# EasyEDA Pro project 2022-4T-MNT-3.eprj

# Schematic EDA3.2
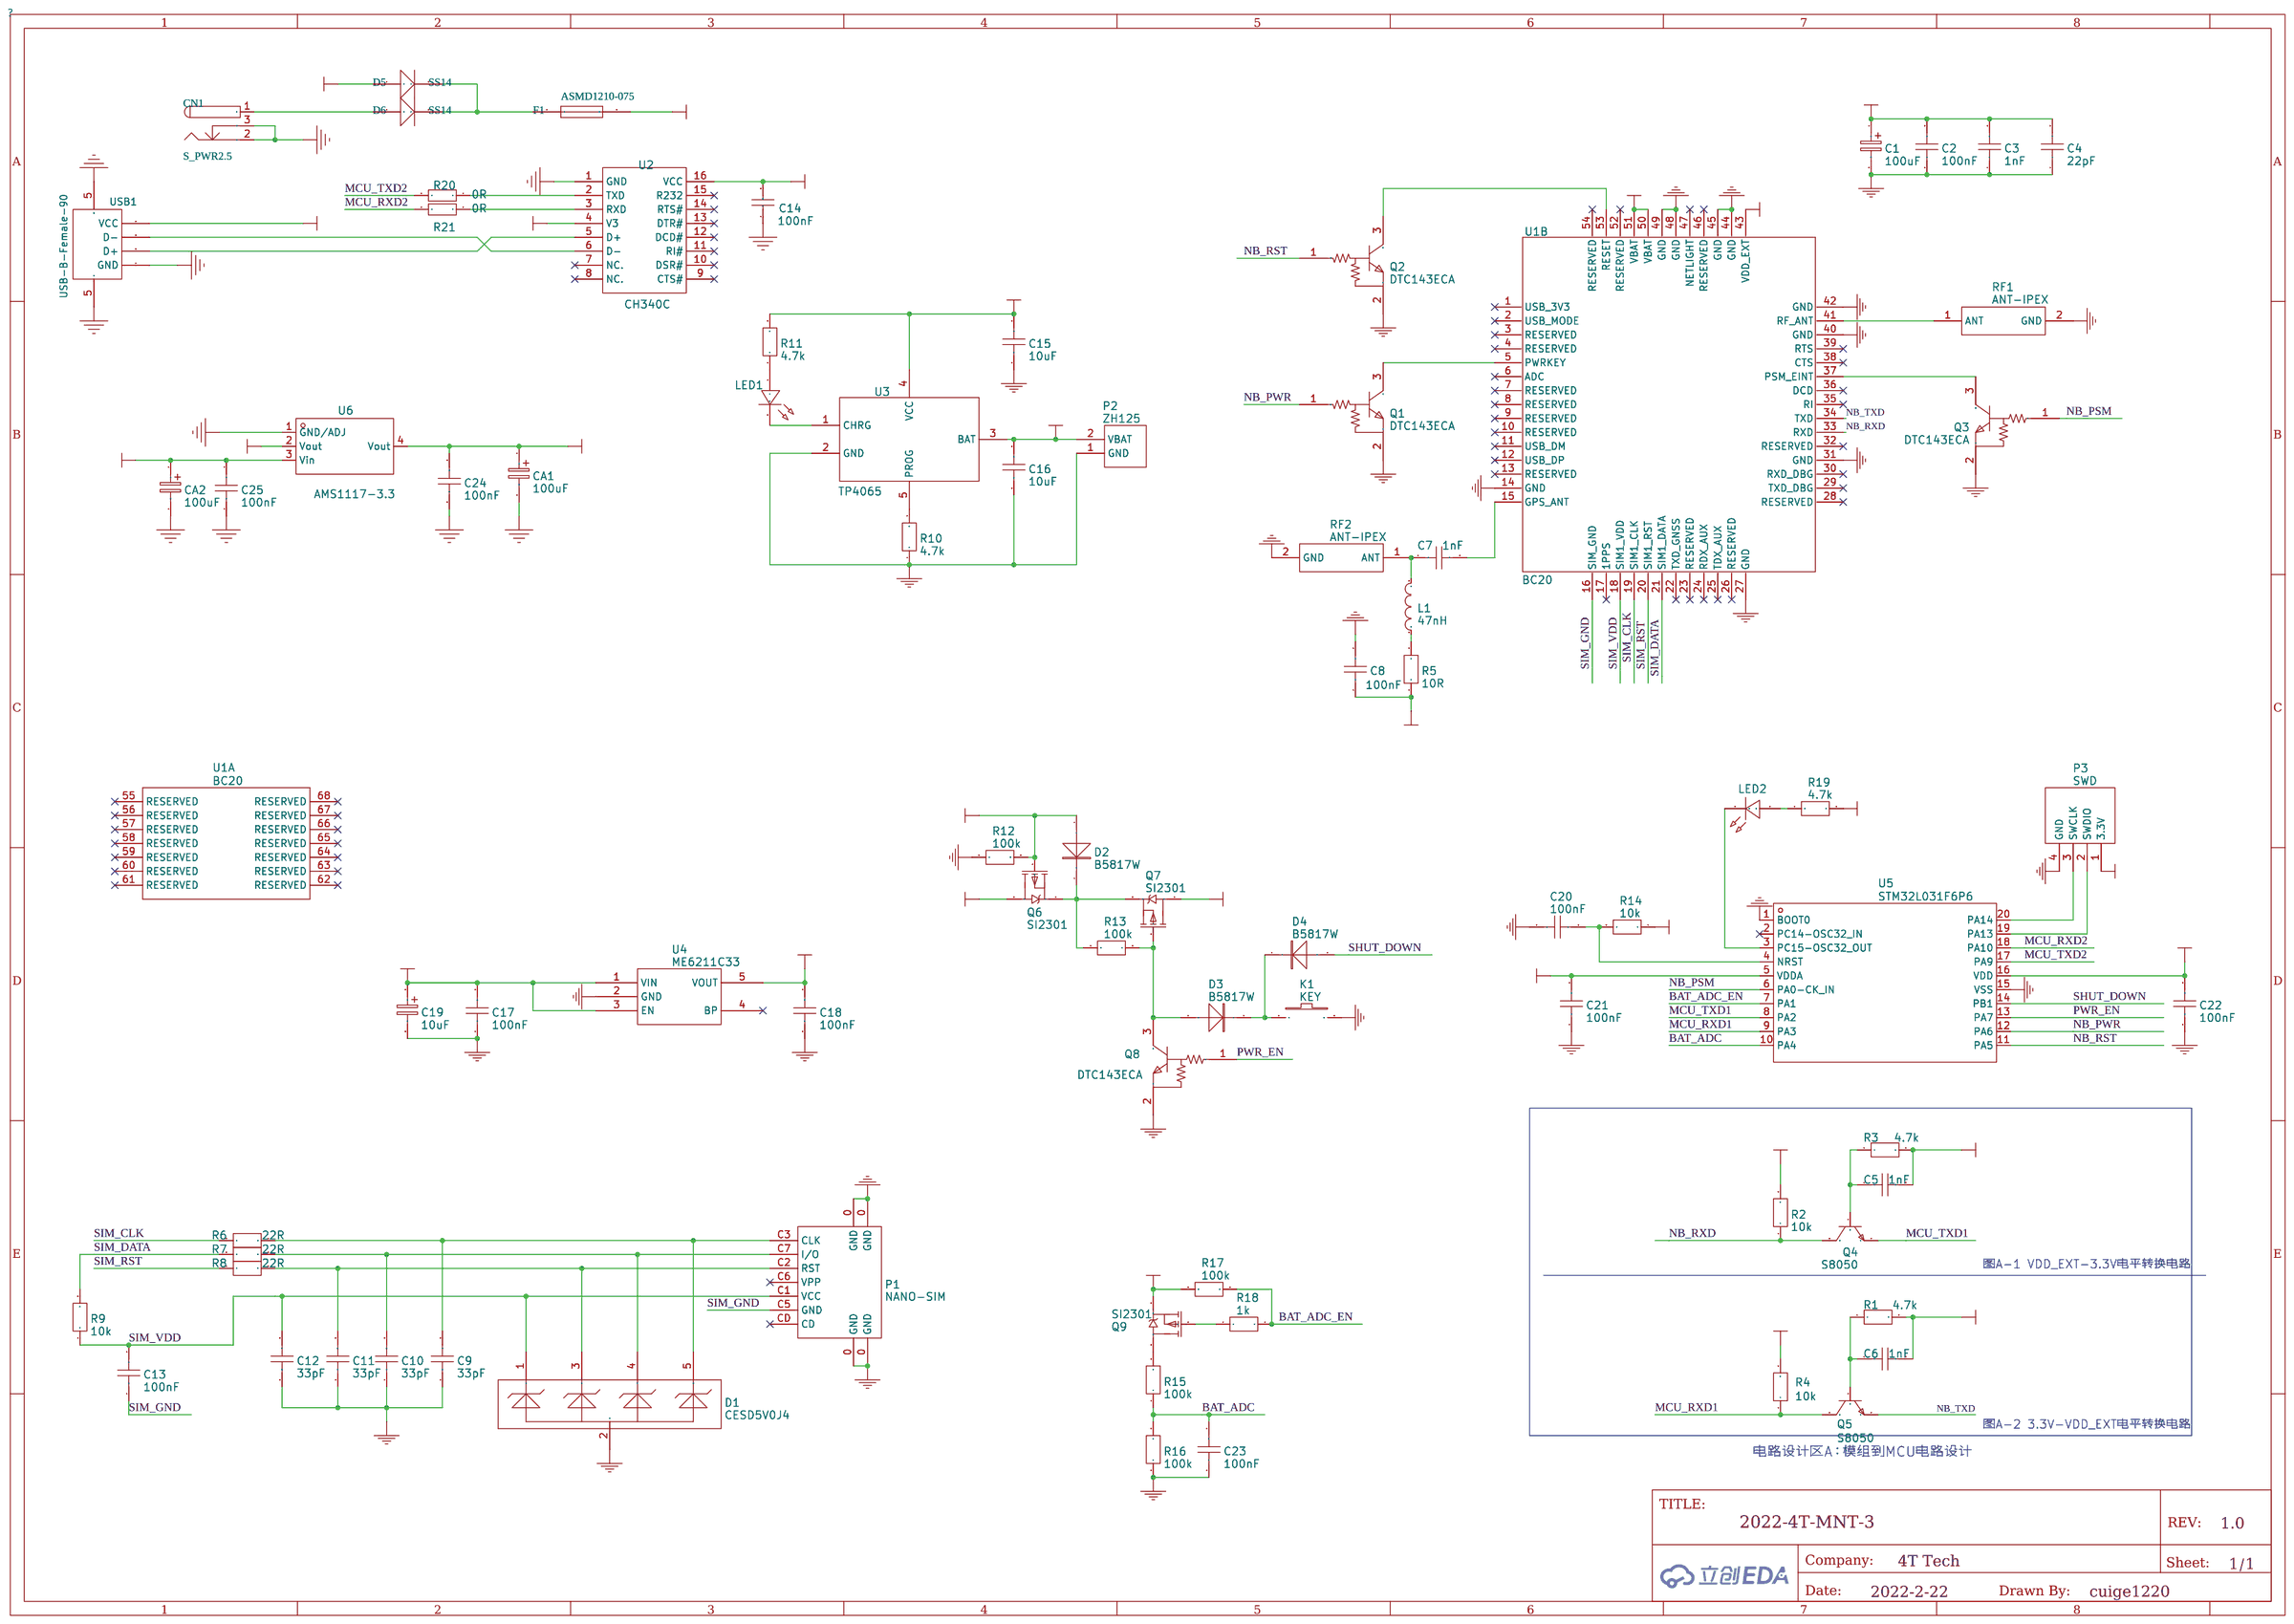
[diagram p0: schematic sheet]

## Parts
C1  100uF  [C0805]
C2  100nF  [C0805]
C3  1nF  [C0805]
C4  22pF  [C0805]
C5  1nF  [C0805]
C6  1nF  [C0805]
C7  1nF  [C0805]
C8  100nF  [C0805]
C9  33pF  [C0805]
C10  33pF  [C0805]
C11  33pF  [C0805]
C12  33pF  [C0805]
C13  100nF  [C0805]
C14  100nF  [C0805]
C15  10uF  [C0805]
C16  10uF  [C0805]
C17  100nF  [C0805]
C18  100nF  [C0805]
C19  10uF  [C_CAP-6*H]
C20  100nF  [C0805]
C21  100nF  [C0805]
C22  100nF  [C0805]
C23  100nF  [C0805]
C24  100nF  [C0805]
C25  100nF  [C0805]
CA1  100uF  [C_CAP-6*H]
CA2  100uF  [C_CAP-6*H]
CN1  S_PWR2.5  [PWR2.5]
D1  CESD5V0J4  [SOT-353]
D2  B5817W  [SOD-123]
D3  B5817W  [SOD-123]
D4  B5817W  [SOD-123]
D5  SS14  [D_DIO-SMA]
D6  SS14  [D_DIO-SMA]
F1  ASMD1210-075  [R_R1210]
K1  KEY  [SW-SMD_TSA365G00D-250]
L1  47nH  [L0805]
LED1  LED-0805_R  [LED0805_RED]
LED2  LED-0805_R  [LED0805_RED]
P1  NANO-SIM  [SIM-NANO_SMN-303]
P2  ZH125  [HDR-M-2.54_1X2]
P3  SWD  [HDR-M-2.54_1X4]
Q1  DTC143ECA  [SOT-23]
Q2  DTC143ECA  [SOT-23]
Q3  DTC143ECA  [SOT-23]
Q4  S8050  [SOT-23]
Q5  S8050  [SOT-23]
Q6  SI2301  [SOT-23]
Q7  SI2301  [SOT-23]
Q8  DTC143ECA  [SOT-23]
Q9  SI2301  [SOT-23]
R1  4.7k  [R0805]
R2  10k  [R0805]
R3  4.7k  [R0805]
R4  10k  [R0805]
R5  10R  [R0805]
R6  22R  [R0805]
R7  22R  [R0805]
R8  22R  [R0805]
R9  10k  [R0805]
R10  4.7k  [R0805]
R11  4.7k  [R0805]
R12  100k  [R0805]
R13  100k  [R0805]
R14  10k  [R0805]
R15  100k  [R0805]
R16  100k  [R0805]
R17  100k  [R0805]
R18  1k  [R0805]
R19  4.7k  [R0805]
R20  0R  [R0805]
R21  0R  [R0805]
RF1  ANT-IPEX  [ANT-IPEX]
RF2  ANT-IPEX  [ANT-IPEX]
U1  BC20  [LCC54]  (sections 1,2)
U2  CH340C  [SOIC-16_150MIL]
U3  TP4065  [SOT-23-5]
U4  ME6211C33  [SOT-23-5]
U5  STM32L031F6P6  [TSSOP-20]
U6  AMS1117-3.3  [SOP-SOT-223]
USB1  USB-B-Female-90  [S_USB-B]

## Library data of the parts
C1 CA1 CA2 = 100uF
C2 C8 C13 C20-C23 = TCC0603X7R104K500CT: Supplier Part: C282519; Supplier: LCSC; Manufacturer: CCTC
C3 C7 = CL10C101JB8NNNC: Supplier Part: C14858; Supplier: LCSC; Manufacturer: SAMSUNG
C4 = 22pF
C5 C6 = 1nF
C9-C12 = 33pF
C14 = 0805F104M500NT: Supplier: LCSC; Manufacturer: FH; Supplier Part: C28378
C15 C16 C19 = 10uF
C17 C18 C24 C25 = 100nF
CN1 = S_PWR2.5
D1 = CESD5V0J4: Supplier: LCSC; Manufacturer: CJ江苏长电; Supplier Part: C148117
D2-D4 = B5817W: Supplier: LCSC; Supplier Part: C8597; Manufacturer: CJ江苏长电
D5 D6 = SS14: Published: 8-Jun-2000; LatestRevisionDate: 17-Jul-2002; LatestRevisionNote: Re-released for DXP Platform.; PackageVersion: Sep-1996; PackageReference: SMC; Publisher: Altium Limited; PackageDescription: DO-214-AB/SMC; 2 C-Bend Leads; Body 7.9 x 5.9 mm, inc. leads (LxW); Code_JEDEC: DO-214-AB
F1 = ASMD1210-075: Published: 8-Jun-2000; LatestRevisionDate: 17-Jul-2002; LatestRevisionNote: Re-released for DXP Platform.; PackageReference: PIN-W2/E2.8; Publisher: Altium Limited; PackageDescription: Thru-Hole; 2 Leads
K1 = TSA365G00D-250: Manufacturer: BRIGHT(博瑞泰); Supplier: LCSC; Supplier Part: C354950
L1 = 47nH
LED1 LED2 = 17-21SURC/S530-A3/TR8: Manufacturer: EVERLIGHT(台湾亿光); Supplier Part: C72037
P1 = SMN-303: Supplier: LCSC; Supplier Part: C266888; Manufacturer: XUNPU(讯普)
P2 = 1251SMT-2P 卧贴: Supplier: LCSC; Supplier Part: C132528; Manufacturer: Ckmtw(灿科盟)
P3 = A2541WV-4P: Manufacturer: CJT(长江连接器); Supplier: LCSC; Supplier Part: C225479
Q1-Q3 Q8 = DTC143ECA: Supplier: LCSC; Supplier Part: C13871; Manufacturer: CJ江苏长电
Q4 Q5 = S8050: Supplier Part: C266592; Supplier: LCSC; Manufacturer: BORN伯恩半导体
Q6 Q7 Q9 = SI2301: Supplier: LCSC; Supplier Part: C181086; Manufacturer: Hottech(合科泰)
R1 R3 R10 R11 R19 = 4.7k: Supplier: LCSC
R2 R4 R9 R14 = 10k
R5 = 10R
R6-R8 = 22R
R12 R13 R15-R17 = 100k
R18 = 1k
R20 R21 = 080500J0104T5E: Supplier: LCSC; Manufacturer: UniOhm; Supplier Part: C149503
RF1 RF2 = KH-IPEX-K501-29: Supplier: LCSC; Supplier Part: C411563; Manufacturer: Shenzhen Kinghelm Elec
U1 = BC20NA-04-STD: Supplier Part: https://detail.tmall.com/item.htm?spm=a230r.1.14.18.7dd211f0yN2FLL&amp;id=579985353551&amp;ns=1&amp;abbucket=20&amp;skuId=3861035545846; Manufacturer: 上海移远
U2 = CH340C: Supplier: LCSC; Manufacturer: WCH; Supplier Part: C84681; JLCPCB Part Class: Extend
U3 = TP4065-4.2V-SOT25-R: Supplier: LCSC; Supplier Part: C113540; Manufacturer: TOPPOWER(南京拓微)
U4 = ME6211C33M5G-N: Manufacturer: MICRONE(南京微盟); Supplier: LCSC; Supplier Part: C82942
U5 = STM32L031F6P6: Supplier: LCSC; Supplier Part: C115208; Manufacturer: ST(意法半导体)
U6 = AMS1117-3.3: Supplier: LCSC; Manufacturer: AMS; image: //image.lceda.cn/szlcsc/C6186.jpg; Supplier Part: C6186; JLCPCB Part Class: Basic; JLCPCB SMD: Yes
USB1 = USB-BF90: Supplier: LCSC; Manufacturer: ValuePro; image: //image.lceda.cn/szlcsc/C46392.jpg; Supplier Part: C46392

## Nets
3.3V: C1.1 C2.2 C3.2 C4.2 C5.2 C8.1 C14.2 C18.2 C21.2 C22.2 C24.2 CA1.1 P3.1(3.3V) R3.2 R4.2 R5.1 R14.1 R19.2 U1.50(VBAT) U1.51(VBAT) U2.4(V3) U2.16(VCC) U4.5(VOUT) U5.5(VDDA) U5.16(VDD) U6.2(Vout) U6.4(Vout)
+5V0: C25.2 CA2.1 F1.2 U6.3(Vin)
GND: C1.2 C2.1 C3.1 C4.1 C8.2 C9.1 C10.1 C11.1 C12.1 C14.1 C15.1 C16.1 C17.1 C18.1 C19.2 C20.1 C21.1 C22.1 C23.1 C24.1 C25.1 CA1.2 CA2.2 CN1.2 CN1.3 D1.2 K1.2 P1.0(GND) P2.1(GND) P3.4(GND) Q1.2(E) Q2.2(E) Q3.2(E) Q8.2(E) R10.1 R12.1 R16.1 RF1.2(GND) RF2.2(GND) U1.14(GND) U1.27(GND) U1.31(GND) U1.40(GND) U1.42(GND) U1.44(GND) U1.45(GND) U1.48(GND) U1.49(GND) U2.1(GND) U3.2(GND) U4.2(GND) U5.1(BOOT0) U5.15(VSS) U6.1(GND/ADJ) USB1.4(GND) USB1.5(SH2)
VBAT: C16.2 P2.2(VBAT) Q6.3(D) Q9.2(S) R17.1 U3.3(BAT)
VCC: C17.2 C19.1 Q7.3(D) U4.1(VIN) U4.3(EN)
VDD_EXT: C6.2 R1.2 R2.2 U1.43(VDD_EXT)
BAT_ADC: C23.2 R15.1 R16.2 U5.10(PA4)
BAT_ADC_EN: R17.2 R18.2 U5.7(PA1)
MCU_RXD1: Q5.3(C) R4.1 U5.9(PA3)
MCU_RXD2: R21.2 U5.18(PA10)
MCU_TXD1: Q4.2(E) U5.8(PA2)
MCU_TXD2: R20.2 U5.17(PA9)
NB_PSM: Q3.1(B) U5.6(PA0-CK_IN)
NB_PWR: Q1.1(B) U5.12(PA6)
NB_RST: Q2.1(B) U5.11(PA5)
NB_RXD: Q4.3(C) R2.1 U1.33(RXD)
NB_TXD: Q5.2(E) U1.34(TXD)
PWR_EN: Q8.1(B) U5.13(PA7)
SHUT_DOWN: D4.A U5.14(PB1)
SIM_CLK: R6.1 U1.19(SIM1_CLK)
SIM_DATA: R7.1 R9.2 U1.21(SIM1_DATA)
SIM_GND: C13.1 P1.C5(GND) U1.16(SIM_GND)
SIM_RST: R8.1 U1.20(SIM1_RST)
SIM_VDD: C12.2 C13.2 D1.1 P1.C1(VCC) R9.1 U1.18(SIM1_VDD)
VUSB: C15.2 D2.A D5.1(A) Q6.1(G) R11.2 R12.2 U3.4(VCC) USB1.1(VCC)
$1N61: D2.K Q6.2(S) Q7.2(S) R13.1
$1N62: LED2.2 U5.3(PC15-OSC32_OUT)
$1N67: LED2.1 R19.1
$1N93: Q9.1(G) R18.1
$1N170: P3.2(SWDIO) U5.19(PA13)
$1N171: P3.3(SWCLK) U5.20(PA14)
$1N218: C20.2 R14.2 U5.4(NRST)
$1N296: D3.K D4.K K1.1
$1N321: D3.A Q7.1(G) Q8.3(C) R13.2
$1N422: LED1.2 U3.1(CHRG)
$1N552: C11.2 D1.3 P1.C2(RST) R8.2
$1N553: C10.2 D1.4 P1.C7(I/O) R7.2
$1N554: C9.2 D1.5 P1.C3(CLK) R6.2
$1N639: L1.1 R5.2
$1N640: C7.1 L1.2 RF2.1(ANT)
$1N672: C7.2 U1.15(GPS_ANT)
$1N686: RF1.1(ANT) U1.41(RF_ANT)
$1N731: C5.1 Q4.1(B) R3.1
$1N792: Q3.3(C) U1.37(PSM_EINT)
$1N808: Q2.3(C) U1.53(RESET)
$1N824: Q1.3(C) U1.5(PWRKEY)
$1N1102: CN1.1 D6.1(A)
$1N1103: D5.2(K) D6.2(K) F1.1
$1N1115: R21.1 U2.3(RXD)
$1N1122: R20.1 U2.2(TXD)
$1N1125: U2.5(D+) USB1.3(D+)
$1N1126: U2.6(D-) USB1.2(D-)
$1N1265: Q9.3(D) R15.2
$1N1284: LED1.1 R11.1
$1N1285: R10.2 U3.5(PROG)
$1N2740: C6.1 Q5.1(B) R1.1

Not connected (* = marked no-connect by the designer): P1 C6(VPP)* CD*; U1 1(USB_3V3)* 2(USB_MODE)* 3(RESERVED)* 4(RESERVED)* 6(ADC)* 7(RESERVED)* 8(RESERVED)* 9(RESERVED)* 10(RESERVED)* 11(USB_DM)* 12(USB_DP)* 13(RESERVED)* 17(1PPS)* 22(TXD_GNSS)* 23(RESERVED)* 24(RDX_AUX)* 25(TDX_AUX)* 26(RESERVED)* 28(RESERVED)* 29(TXD_DBG)* 30(RXD_DBG)* 32(RESERVED)* 35(RI)* 36(DCD)* 38(CTS)* 39(RTS)* 46(RESERVED)* 47(NETLIGHT)* 52(RESERVED)* 54(RESERVED)* 55(RESERVED)* 56(RESERVED)* 57(RESERVED)* 58(RESERVED)* 59(RESERVED)* 60(RESERVED)* 61(RESERVED)* 62(RESERVED)* 63(RESERVED)* 64(RESERVED)* 65(RESERVED)* 66(RESERVED)* 67(RESERVED)* 68(RESERVED)*; U2 7(NC.)* 8(NC.)* 9(CTS#)* 10(DSR#)* 11(RI#)* 12(DCD#)* 13(DTR#)* 14(RTS#)* 15(R232)*; U4 4(BP)*; U5 2(PC14-OSC32_IN)*

## Notes on the sheet
- 图A-1 VDD_EXT-3.3V电平转换电路
- 图A-2 3.3V-VDD_EXT电平转换电路
- 电路设计区A：模组到MCU电路设计

# Board PCB1
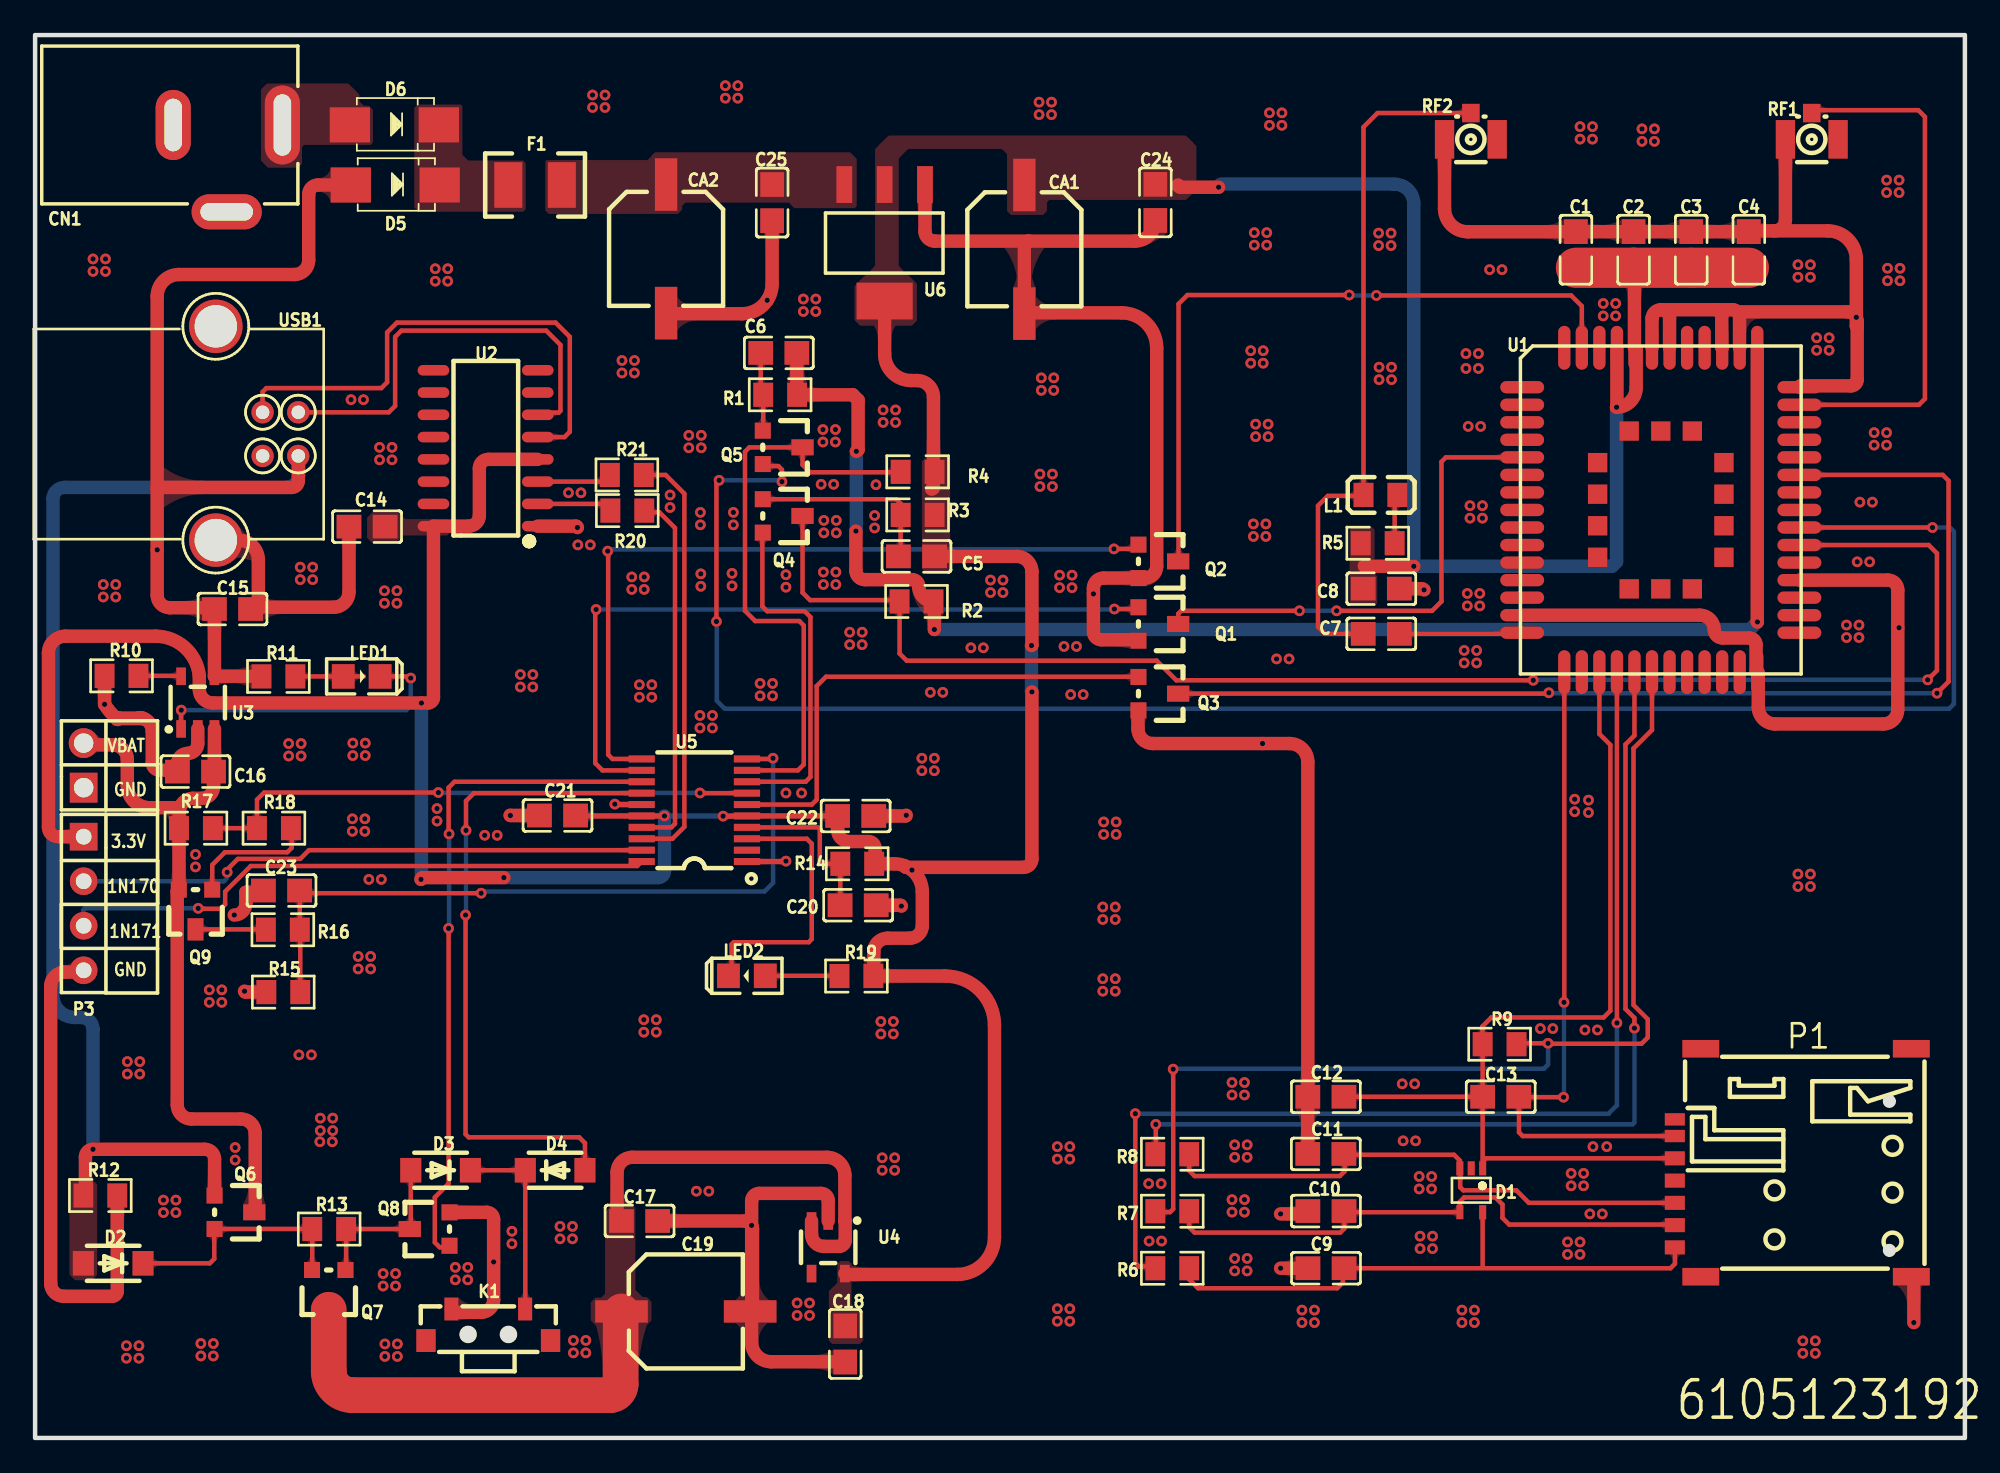
[diagram p1: board, top side]
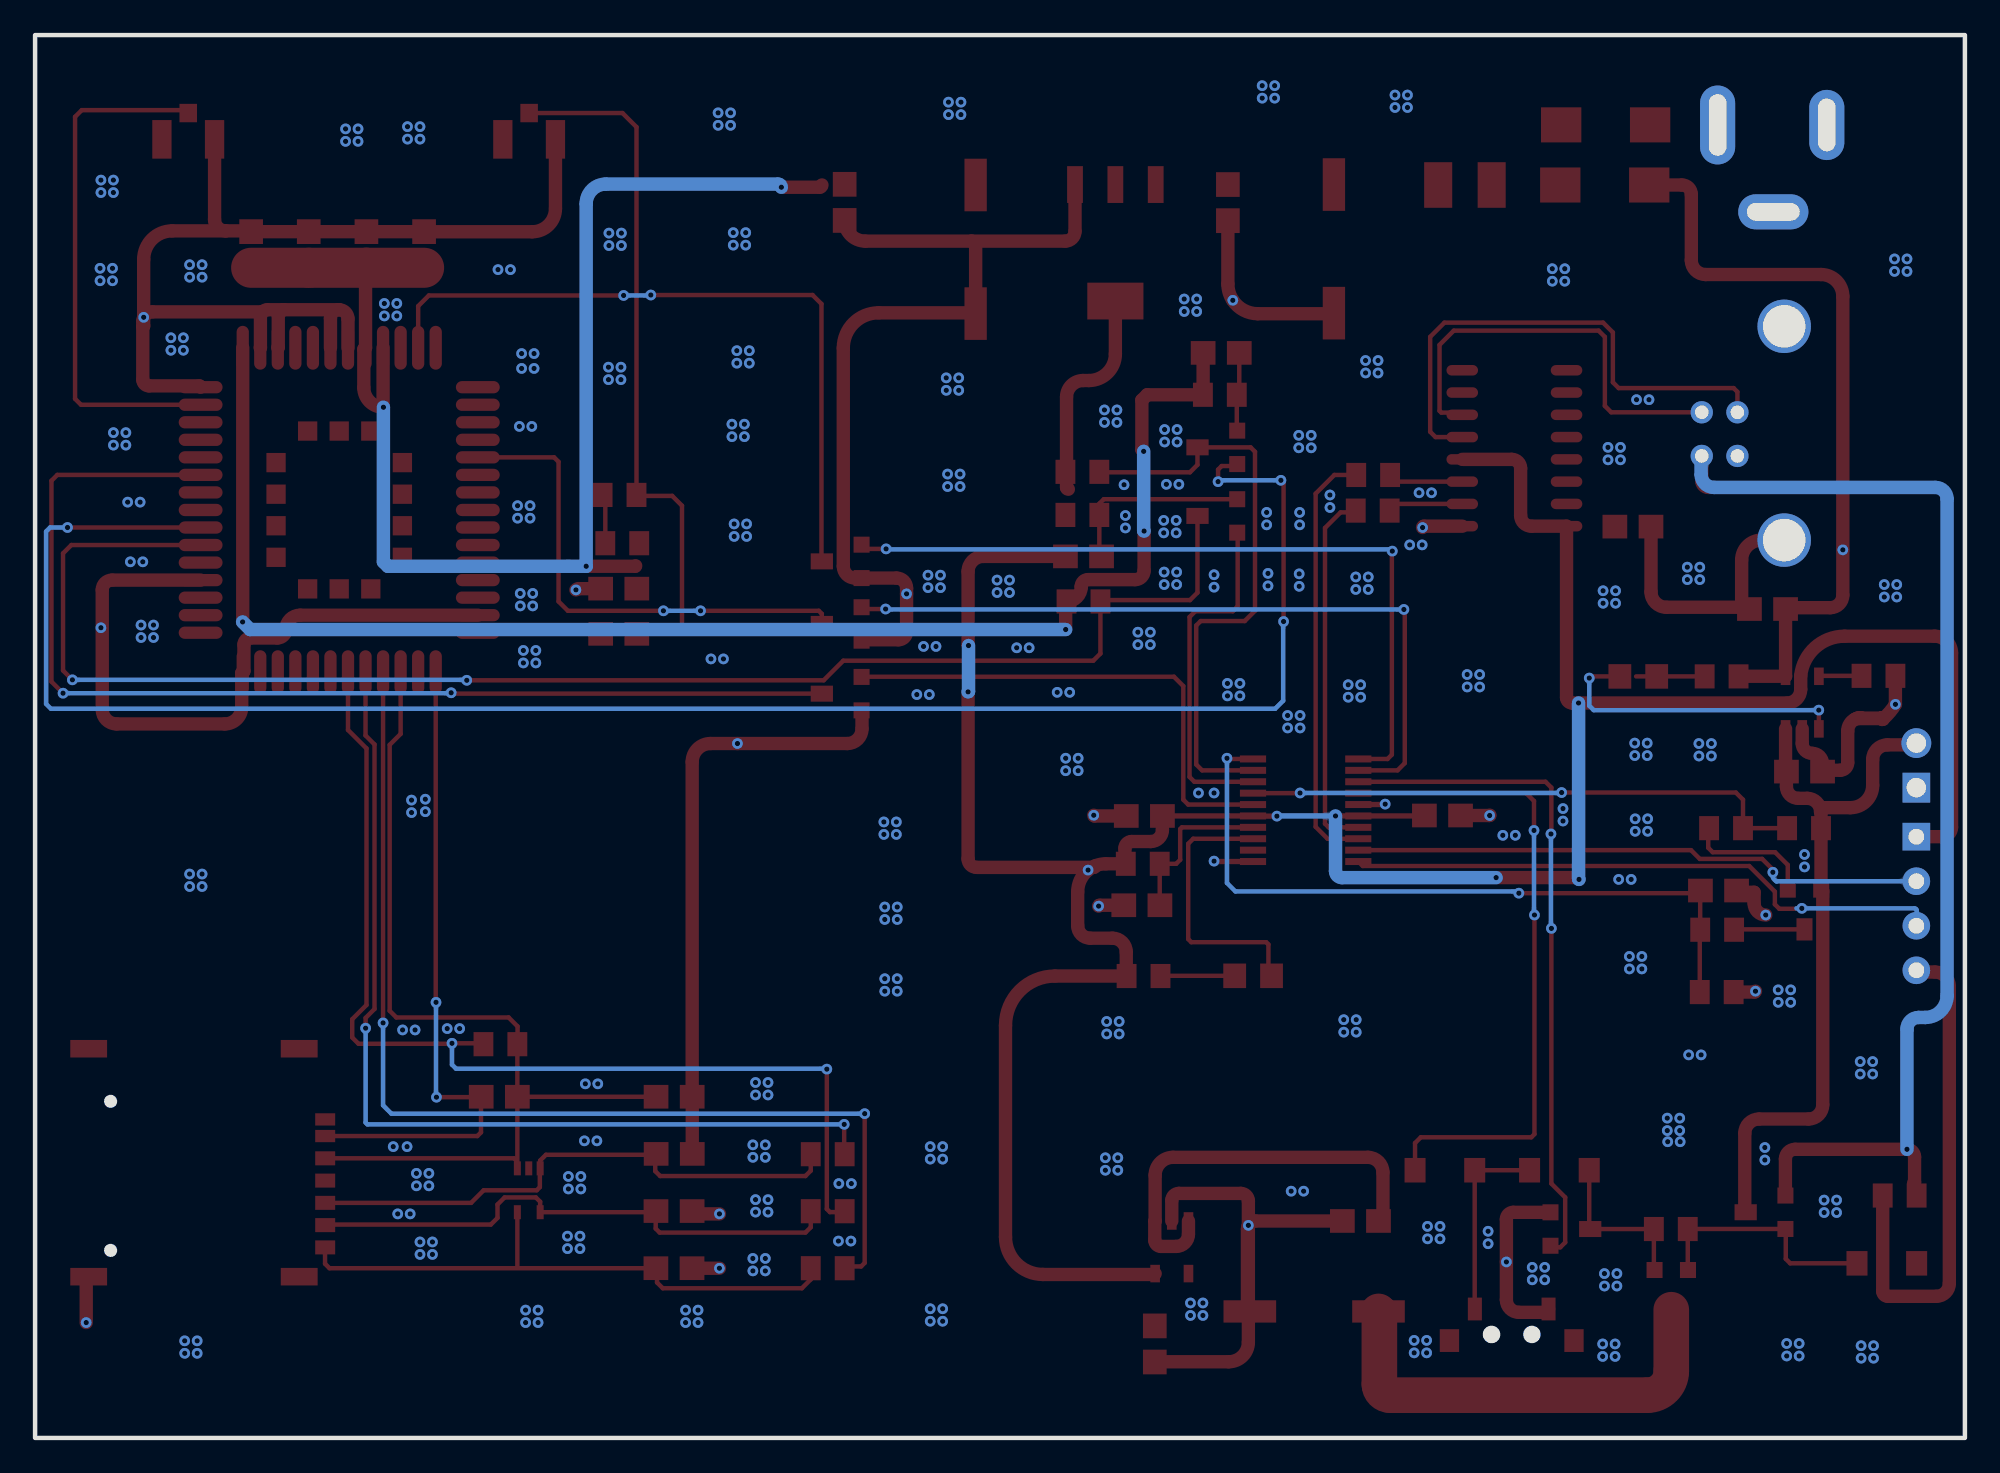
[diagram p2: board, bottom side, seen from below]

Outline 110 x 80 mm; copper layers: Top Layer, Bottom Layer. Coordinates in mm from the lower left corner of the outline.
Outline path: rectangle 0,80 110,0
Stack: Top Layer 0.035mm / Dielectric1 1.51mm FR4 er 4.5 / Bottom Layer 0.035mm

## Design rules (mm)
template: 自定义配置
spacing copperThickness1oz (default): track to track 0.102, other pairs 0.152 to 0.3
spacing copperThickness2oz: track to track 0.203, other pairs 0.152 to 0.3
track width copperThickness1oz (default): min 0.127, default 0.254, max 2.54
track width copperThickness2oz: min 0.203, default 0.254, max 2.54
track width PWR: min 0.305, default 0.762, max 2.54
differential pair differentialPair (default): width min 0.127, default 0.254, max 2.54; gap min 0.152, default 0.152
via viaSize (default): diameter min 0.5, default 0.61, max 10; hole min 0.3, default 0.305, max 6.299
net GND uses PWR
net 3.3V uses PWR
net VCC uses PWR
net VBAT uses PWR
net VUSB uses PWR
net VDD_EXT uses PWR
net +5V0 uses PWR

## Placement (name value [footprint] x y rotation side)
C1  100uF  [C0805]  87.83 67.76 90 top
C2  100nF  [C0805]  91.11 67.76 270 top
C3  1nF  [C0805]  94.4 67.76 270 top
C4  22pF  [C0805]  97.69 67.76 270 top
C5  1nF  [C0805]  50.24 50.27 0 top
C6  1nF  [C0805]  42.39 61.87 0 top
C7  1nF  [C0805]  76.73 45.85 0 top
C8  100nF  [C0805]  76.73 48.43 0 top
C9  33pF  [C0805]  73.58 9.68 0 top
C10  33pF  [C0805]  73.58 12.94 0 top
C11  33pF  [C0805]  73.57 16.2 0 top
C12  33pF  [C0805]  73.58 19.46 0 top
C13  100nF  [C0805]  83.54 19.46 180 top
C14  100nF  [C0805]  18.92 51.97 0 top
C15  10uF  [C0805]  11.25 47.27 180 top
C16  10uF  [C0805]  9.14 38 0 top
C17  100nF  [C0805]  34.46 12.37 180 top
C18  100nF  [C0805]  46.18 5.36 90 top
C19  10uF  [C_CAP-6*H]  33.43 7.21 0 top
C20  100nF  [C0805]  46.91 30.38 180 top
C21  100nF  [C0805]  29.78 35.49 0 top
C22  100nF  [C0805]  46.77 35.47 180 top
C23  100nF  [C0805]  14.05 31.22 0 top
C24  100nF  [C0805]  63.86 70.46 90 top
C25  100nF  [C0805]  42.01 70.45 90 top
CA1  100uF  [C_CAP-6*H]  56.39 71.45 270 top
CA2  100uF  [C_CAP-6*H]  35.97 71.48 270 top
CN1  S_PWR2.5  [PWR2.5]  8 75 0 top
D1  CESD5V0J4  [SOT-353]  81.86 14.12 90 top
D2  B5817W  [SOD-123]  4.45 9.96 0 top
D3  B5817W  [SOD-123]  23.11 15.27 0 top
D4  B5817W  [SOD-123]  29.64 15.27 180 top
D5  SS14  [D_DIO-SMA]  17.98 71.45 0 top
D6  SS14  [D_DIO-SMA]  17.93 74.88 0 top
F1  ASMD1210-075  [R_R1210]  26.97 71.45 0 top
K1  KEY  [SW-SMD_TSA365G00D-250]  25.83 6.45 180 top
L1  47nH  [L0805]  76.69 53.78 180 top
LED1  LED-0805_R  [LED0805_RED]  18.62 43.43 0 top
LED2  LED-0805_R  [LED0805_RED]  40.57 26.35 180 top
P1  NANO-SIM  [SIM-NANO_SMN-303]  94.94 9.19 90 top
P2  ZH125  [HDR-M-2.54_1X2]  2.77 38.35 90 top
P3  SWD  [HDR-M-2.54_1X4]  2.77 30.48 270 top
Q1  DTC143ECA  [SOT-23]  63.91 46.42 180 top
Q2  DTC143ECA  [SOT-23]  63.91 49.99 180 top
Q3  DTC143ECA  [SOT-23]  63.91 42.44 180 top
Q4  S8050  [SOT-23]  42.49 52.58 180 top
Q5  S8050  [SOT-23]  42.49 56.49 180 top
Q6  SI2301  [SOT-23]  11.25 12.87 180 top
Q7  SI2301  [SOT-23]  16.74 8.56 90 top
Q8  DTC143ECA  [SOT-23]  22.61 11.91 0 top
Q9  SI2301  [SOT-23]  9.14 30.25 90 top
R1  4.7k  [R0805]  42.47 59.49 0 top
R2  10k  [R0805]  50.24 47.7 0 top
R3  4.7k  [R0805]  50.3 52.64 0 top
R4  10k  [R0805]  50.3 55.09 0 top
R5  10R  [R0805]  76.53 51.02 0 top
R6  22R  [R0805]  64.82 9.68 0 top
R7  22R  [R0805]  64.82 12.93 0 top
R8  22R  [R0805]  64.82 16.18 0 top
R9  10k  [R0805]  83.48 22.45 0 top
R10  4.7k  [R0805]  4.93 43.46 0 top
R11  4.7k  [R0805]  13.87 43.43 180 top
R12  100k  [R0805]  3.72 13.82 180 top
R13  100k  [R0805]  16.76 11.91 0 top
R14  10k  [R0805]  46.86 32.74 180 top
R15  100k  [R0805]  14.12 28.98 180 top
R16  100k  [R0805]  14.15 25.43 0 top
R17  100k  [R0805]  9.17 34.77 0 top
R18  1k  [R0805]  13.61 34.77 180 top
R19  4.7k  [R0805]  46.82 26.34 0 top
R20  0R  [R0805]  33.76 52.88 0 top
R21  0R  [R0805]  33.73 54.91 0 top
RF1  -  [ANT-IPEX]  101.27 74.8 0 top
RF2  -  [ANT-IPEX]  81.84 74.8 0 top
U1  BC20  [LCC54]  84.76 59.92 0 top
U2  CH340C  [SOIC-16_150MIL]  25.68 56.44 90 top
U3  TP4065  [SOT-23-5]  9.27 41.93 0 top
U4  ME6211C33  [SOT-23-5]  45.21 10.87 180 top
U5  STM32L031F6P6  [TSSOP-20]  37.58 35.79 90 top
U6  AMS1117-3.3  [SOP-SOT-223]  50.72 71.48 270 top
USB1  USB-B-Female-90  [S_USB-B]  15 56 270 top

## Footprints (pads in the part's own frame, mm; a bottom-side part is the same pattern mirrored in y, then rotated)
ANT-IPEX
  rect 1x1.05 smd: 1(0,0.75)
  rect 1.1x2.2 smd: 2(-1.5,-0.75) 3(1.5,-0.75)
C0805
  rect 1.41x1.35 smd: 1(-1.03,0.001) 2(1.03,0.001)
C_CAP-6*H
  rect 3x1.274 smd: 1(-0.001,0.001) 2(7.333,0.001)
D_DIO-SMA
  rect 2.3x2 smd: 1(0.01,0) 2(5.08,0)
HDR-M-2.54_1X2
  rect 1.7x1.575 hole 1.105x1.1: 1(-1.27,0)
  round 1.7 hole 1.105x1.1: 2(1.27,0)
HDR-M-2.54_1X4
  rect 1.575x1.575 hole 0.894x0.889: 1(-3.81,0)
  round 1.575 hole 0.894x0.889: 2(-1.27,0) 3(1.27,0) 4(3.81,0)
L0805
  rect 1.133x1.377 smd: 1(-0.966,0) 2(0.966,0)
LCC54
  oval 2.5x0.7 smd: 1(0,0) 2(0,-1) 3(0,-2) 4(0,-3) 5(0,-4) 6(0,-5) 7(0,-6) 8(0,-7) 9(0,-8) 10(0,-9) 11(0,-10) 12(0,-11) 13(0,-12) 14(0,-13) 15(0,-14) 28(15.8,-14) 29(15.8,-13) 30(15.8,-12) 31(15.8,-11) 32(15.8,-10) 33(15.8,-9) 34(15.8,-8) 35(15.8,-7) 36(15.8,-6) 37(15.8,-5) 38(15.8,-4) 39(15.8,-3) 40(15.8,-2) 41(15.8,-1) 42(15.8,0)
  oval 0.7x2.5 smd: 16(2.4,-16.25) 17(3.4,-16.25) 18(4.4,-16.25) 19(5.4,-16.25) 20(6.4,-16.25) 21(7.4,-16.25) 22(8.4,-16.25) 23(9.4,-16.25) 24(10.4,-16.25) 25(11.4,-16.25) 26(12.4,-16.25) 27(13.4,-16.25) 43(13.4,2.25) 44(12.4,2.25) 45(11.4,2.25) 46(10.4,2.25) 47(9.4,2.25) 48(8.4,2.25) 49(7.4,2.25) 50(6.4,2.25) 51(5.4,2.25) 52(4.4,2.25) 53(3.4,2.25) 54(2.4,2.25)
  rect 1.1x1.1 smd: 55(4.3,-4.3) 56(4.3,-6.1) 57(4.3,-7.9) 58(4.3,-9.7) 59(6.1,-11.5) 60(7.9,-11.5) 61(9.7,-11.5) 62(11.5,-9.7) 63(11.5,-7.9) 64(11.5,-6.1) 65(11.5,-4.3) 66(9.7,-2.5) 67(7.9,-2.5) 68(6.1,-2.5)
LED0805_RED
  rect 1.3x1.399 smd: 1(-1.05,0) 2(1.05,0)
PWR2.5
  oval 2x4.5 hole 1x3.5: 1(6.096,-0.127)
  oval 2x4 hole 1x3: 2(-0.127,-0.127)
  oval 4x2 hole 3x1: 3(2.921,-5.08)
R0805
  rect 1.133x1.377 smd: 1(-0.967,0) 2(0.966,0)
R_R1210
  rect 1.6x2.6 smd: 1(0,0) 2(3.048,0)
S_USB-B
  round 1.27 hole 0.767x0.762: 1(0,0) 2(-2.489,0) 3(-2.489,-2.032) 4(0,-2.032)
  round 3.048 hole 2.418x2.413: 5(4.801,-4.699) 6(-7.391,-4.699)
SIM-NANO_SMN-303
  rect 1x2.1 smd: 0(-0.001,-12) 1(12.999,-12) 2(12.999,0) 3(-0.001,0)
  rect 0.8x1.14 smd: C1(6.75,1.48) C2(4.21,1.48) C3(1.67,1.48) C6(5.48,1.48) C7(2.94,1.48)
  rect 0.7x1.14 smd: C5(8.02,1.48) CD(8.97,1.48)
SOD-123
  rect 1.2x1.4 smd: A(-1.7,0) K(1.7,0)
SOIC-16_150MIL
  oval 0.6x1.8 smd: 1(-4.445,-2.972) 2(-3.175,-2.972) 3(-1.905,-2.972) 4(-0.635,-2.972) 5(0.635,-2.972) 6(1.905,-2.972) 7(3.175,-2.972) 8(4.445,-2.972) 9(4.445,2.972) 10(3.175,2.972) 11(1.905,2.972) 12(0.635,2.972) 13(-0.635,2.972) 14(-1.905,2.972) 15(-3.175,2.972) 16(-4.445,2.972)
SOP-SOT-223
  rect 2.1x0.9 smd: 1(0,0) 2(0,-2.3) 3(0,-4.6)
  rect 2.1x3.2 smd: 4(6.644,-2.3)
SOT-23
  rect 0.914x0.914 smd: 1(1.016,-0.953) 2(1.016,0.953)
  rect 1.27x0.914 smd: 3(-1.25,0)
SOT-23-5
  rect 0.55x1 smd: 1(-0.95,-1.5) 2(0,-1.5) 3(0.95,-1.5) 4(0.95,1.5) 5(-0.95,1.5)
SOT-353
  rect 0.8x0.4 smd: 1(1.25,-0.65) 2(1.25,0) 3(1.25,0.65) 4(-1.25,0.65) 5(-1.25,-0.65)
SW-SMD_TSA365G00D-250
  rect 0.8x1.3 smd: 1(-2.1,-0.9) 2(2.1,-0.9)
  rect 1.1x1.3 smd: 3(-3.55,0.9) 4(3.55,0.9)
TSSOP-20
  rect 0.4x1.494 smd: 1(-2.925,-3.002) 2(-2.275,-3.001) 3(-1.625,-3.001) 4(-0.975,-3.001) 5(-0.325,-3.001) 6(0.324,-3.001) 7(0.975,-3.001) 8(1.625,-3.001) 9(2.275,-3.001) 10(2.925,-3.001) 11(2.925,3.001) 12(2.275,3.001) 13(1.625,3.001) 14(0.975,3.001) 15(0.325,3.001) 16(-0.325,3.001) 17(-0.975,3.001) 18(-1.625,2.996) 19(-2.275,2.996) 20(-2.925,3.001)

## Nets
As in the schematic.

Pads without a net: K1 3 4; P1 1 2 3 C6 CD; RF1 3; RF2 3; U1 1 2 3 4 6 7 8 9 10 11 12 13 17 22 23 24 25 26 28 29 30 32 35 36 38 39 46 47 52 54 55 56 57 58 59 60 61 62 63 64 65 66 67 68; U2 7 8 9 10 11 12 13 14 15; U4 4; U5 2; USB1 6

## Via types
v1: diameter 0.61, hole 0.305, Top Layer to Bottom Layer, 486 vias

## Routing (per net, layer and track width the routed paths; a pad name or vN(x,y) marks a point on that pad's centre or on a via; arc(x,y) is an arc through that point)
3.3V: length 266.6
  Top Layer w0.305: 30.81,35.49 30.83,35.47 v1(35.88,35.47) 35.89,35.48 ; C22.2 40.58,35.47 40.57,35.46 v1(39.22,35.46)
  Top Layer w0.762: v1(67.46,71.32) 65.28,71.32 arc(65.19,71.36) 65.15,71.45 ; 49.75,32.54 49.66,32.54 arc(49.59,32.56) 49.57,32.62 arc(49.28,32.71) 48.97,32.74 R14.1 arc(47.86,32.76) 47.88,32.79 47.88,33.63 arc(47.77,33.9) 47.5,34.01 46.41,34.01 arc(45.94,34.2) 45.74,34.67 C22.2 ; 49.75,32.54 56.34,32.54 arc(56.68,32.68) 56.82,33.02 v1(56.82,42.55) ; 49.75,32.54 arc(49.87,32.46) v1(49.98,32.38) arc(50.42,31.83) 50.57,31.14 50.57,29.21 arc(50.36,28.71) 49.86,28.5 48.59,28.5 arc(48.03,28.27) 47.8,27.71 47.8,26.36 arc(47.8,26.35) R19.2 51.87,26.34 arc(53.86,25.51) 54.69,23.52 54.69,11.46 arc(54.06,9.95) 52.55,9.32 46.21,9.32 arc(46.17,9.34) U4.5 ; P3.1 1.3,34.29 arc(0.92,34.44) 0.76,34.82 0.76,44.75 arc(1.04,45.44) 1.73,45.72 6.86,45.72 arc(8.54,45.07) 9.36,43.46 9.36,42.69 arc(9.59,42.14) 10.13,41.91 v1(22.02,41.91) 22.39,41.91 arc(22.62,42) 22.71,42.22 U2.16 24.71,51.99 arc(25.15,52.17) 25.32,52.6 25.32,55.3 arc(25.47,55.66) 25.83,55.8 U2.4 ; U6.4 48.42,61.81 arc(48.87,60.74) 49.94,60.3 50.27,60.3 arc(50.93,60.02) 51.21,59.36 51.21,54.2 arc(51.18,54.13) 51.1,54.1 ; U1.51 90.16,58.8 v1(90.14,58.78) arc(90.93,59.1) 91.26,59.89 91.26,62.07 arc(91.23,62.14) U1.50 91.16,66.68 arc(91.15,66.71) 91.12,66.73 arc(91.12,66.73) C2.2 ; 75.77,49.73 75.79,49.71 v1(78.59,49.71) ; C5.2 55.95,50.27 arc(56.57,50.02) 56.82,49.4 56.82,45.21 arc(56.81,45.19) v1(56.79,45.19) ; v1(26.72,31.95) 22.1,31.95 arc(22.03,31.92) v1(22,31.85)
  Top Layer w2.286: 97.68,66.73 C1.1
  Bottom Layer w0.305: v1(39.22,35.46) 39.21,35.47 v1(35.88,35.47)
  Bottom Layer w0.762: v1(22.02,41.91) 22.02,31.88 arc(22.01,31.86) v1(22,31.85) ; v1(56.79,45.19) 56.79,42.57 arc(56.8,42.55) v1(56.82,42.55) ; v1(26.72,31.95) 35.51,31.95 arc(35.77,32.06) 35.88,32.32 v1(35.88,35.47) ; v1(90.14,58.78) 90.14,49.96 89.89,49.71 v1(78.59,49.71) 78.59,70.38 arc(78.26,71.17) 77.47,71.5 67.64,71.5 arc(67.51,71.45) v1(67.46,71.32)
GND: length 324.9
  Top Layer w0.305: 40.58,32.87 42.78,32.87 arc(42.79,32.88) v1(42.8,32.89) ; U5.15 33.07,36.12 arc(33.05,36.13) v1(33.05,36.14)
  Top Layer w0.762: U1.31 105.62,48.92 arc(106.01,48.76) 106.17,48.36 106.17,41.53 arc(105.93,40.95) 105.36,40.72 99.19,40.72 arc(98.5,41) 98.22,41.68 98.22,43.61 arc(98.21,43.65) U1.27 arc(98.12,43.69) 98.09,43.74 98.09,45.24 arc(97.98,45.51) 97.71,45.62 96.19,45.62 arc(95.85,45.76) 95.71,46.1 arc(95.47,46.68) 94.89,46.92 U1.14 ; 4.65,41.02 4.75,41.02 ; 4.65,41.02 arc(4.7,40.97) 4.75,41.02 ; 4.65,41.02 arc(4.7,40.97) 4.75,41.02 ; 4.65,41.02 arc(4.67,41.07) 4.72,41.07 ; 4.65,41.02 arc(4.27,41.4) v1(3.96,41.83) R10.1 ; 4.75,41.02 6.09,41.02 6.11,41.05 ; 4.75,41.02 arc(4.75,41.03) 4.75,41.05 ; 4.75,41.02 arc(4.75,41.03) 4.75,41.05 ; R16.1 11.99,25.43 arc(11.95,25.44) v1(11.94,25.48) ; 56.63,68.25 62.68,68.25 arc(63.51,68.6) C24.1 ; 56.63,68.25 51.28,68.25 arc(50.89,68.41) 50.72,68.81 U6.1 ; 56.63,68.25 arc(56.46,68.18) 56.39,68.01 CA1.2 arc(56.4,64.15) 56.43,64.16 61.93,64.16 arc(63.34,63.57) 63.93,62.15 63.93,49.71 arc(63.73,49.23) 63.26,49.03 Q2.2 60.9,49.03 arc(60.49,48.87) 60.32,48.46 v1(60.32,48.13) 60.32,45.97 arc(60.46,45.65) 60.78,45.52 62.84,45.52 arc(62.88,45.5) Q1.2 ; U4.2 45.21,13.54 arc(45.09,13.83) 44.81,13.94 41.28,13.94 arc(40.97,13.82) 40.84,13.51 v1(40.84,12.12) ; RF1.2 99.77,69.47 arc(99.58,69.02) 99.14,68.83 ; 12.56,47.37 12.38,47.37 arc(12.31,47.34) 12.28,47.27 ; 12.56,47.37 17.02,47.37 arc(17.64,47.63) 17.89,48.25 C14.1 ; 12.56,47.37 arc(12.68,47.52) 12.73,47.71 12.73,50.06 arc(12.39,50.87) 11.59,51.2 USB1.5 ; 92.68,64.34 95.81,64.34 ; 92.68,64.34 arc(93.02,64.2) 93.16,63.86 U1.48 ; 92.68,64.34 arc(92.32,64.19) 92.16,63.82 U1.49 ; 95.81,64.34 96.75,64.34 arc(96.91,64.31) 97.04,64.22 ; 95.81,64.34 arc(96.04,64.24) 96.14,64.01 96.14,62.19 arc(96.15,62.18) U1.45 ; v1(40.84,12.12) 40.84,7.3 ; v1(40.84,12.12) arc(40.67,12.3) 40.44,12.37 C17.1 ; v1(40.84,12.12) arc(40.88,12.02) 40.89,11.91 40.89,7.35 arc(40.88,7.29) 40.84,7.24 ; Q8.2 25.74,12.87 arc(26.02,12.75) 26.14,12.47 v1(26.14,10.04) 26.14,7.87 arc(25.93,7.37) 25.43,7.16 23.92,7.16 arc(23.79,7.22) K1.2 ; 40.84,7.3 40.84,7.24 ; 40.84,7.3 arc(40.82,7.24) C19.2 ; 40.84,7.24 40.84,5.46 arc(41.17,4.67) 41.96,4.34 46.16,4.34 arc(46.17,4.34) C18.1 ; v1(103.81,63.91) 103.81,67.21 arc(103.33,68.36) 102.18,68.83 99.14,68.83 ; v1(103.81,63.91) 103.81,63.41 arc(103.82,63.38) 103.86,63.36 ; v1(103.81,63.91) arc(103.61,64.13) 103.32,64.22 97.04,64.22 ; v1(103.81,63.91) arc(103.85,63.79) 103.86,63.68 103.86,63.36 ; 103.86,63.36 103.86,60.35 arc(103.76,60.1) 103.5,60 100.64,60 arc(100.59,59.97) U1.42 ; C20.1 49.33,30.38 arc(49.36,30.36) v1(49.38,30.33) ; 5.94,41.05 4.75,41.05 ; 5.94,41.05 6.11,41.05 ; 5.94,41.05 5.92,41.07 arc(6.02,41.07) 6.11,41.05 ; 99.14,68.83 97.73,68.83 arc(97.7,68.82) C4.1 ; v1(70.99,9.68) 72.68,9.68 ; 6.11,41.05 arc(6.19,41.02) 6.27,40.99 arc(6.57,40.71) 6.68,40.31 6.68,38.51 arc(6.81,38.2) 7.11,38.07 8.04,38.07 arc(8.09,38.05) 8.11,38 8.11,38.44 arc(8.29,38.86) 8.71,39.04 arc(9.11,39.2) 9.27,39.6 U3.2 ; v1(107.09,6.58) 107.09,9.05 arc(107.04,9.15) P1.0 ; C8.2 78.97,48.43 arc(79.08,48.42) v1(79.17,48.36) ; 80.34,74.05 80.34,70.11 arc(80.73,69.17) 81.66,68.78 87.82,68.78 arc(87.83,68.79) C1.2 97.68,68.79 ; C25.1 42.01,65.81 arc(41.94,65.32) v1(41.73,64.88) arc(41.12,64.31) 40.31,64.11 36,64.11 arc(35.98,64.12) 35.97,64.14 ; 4.75,41.05 4.72,41.07 ; 4.75,41.05 arc(4.74,41.06) 4.72,41.07 ; 4.75,41.05 arc(4.74,41.06) 4.72,41.07 ; R12.1 4.69,8.37 arc(4.6,8.16) 4.39,8.08 1.63,8.08 arc(1.1,8.29) 0.89,8.81 0.89,25.76 arc(1.13,26.33) 1.7,26.57 2.67,26.57 arc(2.74,26.6) P3.4 ; C22.1 49.62,35.47 arc(49.65,35.48) v1(49.66,35.51) ; v1(70.99,12.78) 72.39,12.78 arc(72.5,12.82) C10.1 ; 28.75,35.49 v1(27.09,35.49) arc(27.08,35.5) 27.08,35.51 ; 97.04,64.22 arc(97.12,64.09) 97.16,63.93 97.16,62.18 arc(97.16,62.17) U1.44 ; C11.1 72.54,19.45 arc(72.54,19.46) 72.54,19.46 72.54,38.55 arc(72.24,39.29) 71.5,39.6 v1(69.97,39.6) 63.7,39.6 arc(63.11,39.84) 62.87,40.44 62.87,41.47 arc(62.87,41.48) Q3.2 ; U2.1 30.84,51.99 arc(30.89,51.97) v1(30.91,51.92) ; v1(11.35,29.82) arc(11.82,30.01) 12.01,30.48 12.01,31.11 12.91,31.11 arc(12.99,31.15) C23.1
  vias: v1(3.3,67.23) v1(3.3,66.52) v1(3.89,48.67) v1(3.89,47.95) v1(4.01,67.23) v1(4.01,66.52) v1(4.6,48.67) v1(4.6,47.95) v1(5.21,5.26) v1(5.21,4.55) v1(5.26,21.46) v1(5.26,20.75) v1(5.92,5.26) v1(5.92,4.55) v1(5.97,21.46) v1(5.97,20.75) v1(7.31,13.56) v1(7.31,12.85) v1(8.03,13.56) v1(8.02,12.85) v1(9.14,33.27) v1(9.14,32.56) v1(9.45,5.38) v1(9.45,4.67) v1(9.93,25.55) v1(9.93,24.84) v1(10.16,5.38) v1(10.16,4.67) v1(10.64,25.55) v1(10.64,24.84) v1(11.4,16.56) v1(11.4,15.85) v1(14.45,39.6) v1(14.45,38.89) v1(15.04,21.84) v1(15.11,49.66) v1(15.11,48.95) v1(15.16,39.6) v1(15.16,38.89) v1(15.75,21.84) v1(15.82,49.66) v1(15.82,48.95) v1(16.23,16.89) v1(16.26,18.24) v1(16.26,17.53) v1(16.94,16.89) v1(16.97,18.24) v1(16.97,17.53) v1(18.01,59.21) v1(18.11,39.62) v1(18.11,38.91) v1(18.08,35.31) v1(18.08,34.59) v1(18.42,27.46) v1(18.42,26.75) v1(18.72,59.21) v1(18.82,39.62) v1(18.82,38.91) v1(18.8,35.31) v1(18.79,34.59) v1(19.02,31.85) v1(19.13,27.46) v1(19.12,26.75) v1(19.63,56.49) v1(19.63,55.78) v1(19.74,31.85) v1(19.84,9.37) v1(19.84,8.66) v1(19.91,48.31) v1(19.91,47.6) v1(19.94,5.36) v1(19.94,4.65) v1(20.35,56.49) v1(20.34,55.78) v1(20.55,9.37) v1(20.55,8.66) v1(20.62,48.31) v1(20.62,47.6) v1(20.65,4.65) v1(20.65,5.36) v1(22.81,66.67) v1(22.81,65.96) v1(22.91,35.89) v1(22.91,35.18) v1(23.52,66.67) v1(23.52,65.96) v1(23.95,9.73) v1(23.95,9.02) v1(24.66,9.73) v1(24.66,9.02) v1(25.63,34.37) v1(26.34,34.37) v1(27.18,11.79) v1(27.18,11.07) v1(27.66,43.54) v1(27.66,42.82) v1(28.37,43.54) v1(28.37,42.82) v1(29.92,12.06) v1(29.92,11.35) v1(30.4,53.9) v1(30.63,12.06) v1(30.63,11.35) v1(30.68,5.56) v1(30.68,4.85) v1(30.94,50.93) v1(31.11,53.9) v1(31.39,5.56) v1(31.39,4.85) v1(31.65,50.93) v1(31.78,76.58) v1(31.78,75.87) v1(32.49,76.58) v1(32.48,75.87) v1(33.45,61.44) v1(33.45,60.73) v1(34.01,49.1) v1(34.01,48.39) v1(34.16,61.44) v1(34.16,60.73) v1(34.44,42.95) v1(34.44,42.24) v1(34.72,49.1) v1(34.72,48.39) v1(34.7,23.85) v1(34.7,23.14) v1(35.15,42.95) v1(35.15,42.24) v1(35.41,23.85) v1(35.41,23.14) v1(36.19,53.77) v1(36.19,53.06) v1(37.26,57.18) v1(37.26,56.46) v1(37.69,14.07) v1(37.92,52.78) v1(37.92,52.07) v1(37.95,49.27) v1(37.95,48.57) v1(37.9,41.2) v1(37.9,40.49) v1(37.97,57.18) v1(37.97,56.46) v1(38.4,14.07) v1(38.61,41.2) v1(38.61,40.49) v1(39.34,77.11) v1(39.34,76.4) v1(39.73,49.3) v1(39.73,48.59) v1(39.8,52.78) v1(39.8,52.07) v1(40.06,77.11) v1(40.05,76.4) v1(41.33,43.03) v1(41.33,42.32) v1(42.04,43.03) v1(42.03,42.32) v1(42.8,49.22) v1(42.8,48.51) v1(42.8,36.78) v1(43.43,7.7) v1(43.43,6.98) v1(43.69,36.78) v1(43.79,64.95) v1(43.79,64.24) v1(44.15,7.7) v1(44.14,6.98) v1(44.5,64.95) v1(44.5,64.24) v1(44.81,54.38) v1(44.91,57.51) v1(44.91,56.79) v1(44.93,49.38) v1(44.93,48.67) v1(44.96,52.32) v1(44.96,51.61) v1(45.52,54.38) v1(45.62,57.51) v1(45.62,56.79) v1(45.64,49.38) v1(45.64,48.67) v1(45.67,52.32) v1(45.67,51.61) v1(46.43,45.95) v1(46.43,45.24) v1(47.14,45.95) v1(47.14,45.24) v1(47.93,54.36) v1(47.85,52.6) v1(47.85,51.89) v1(48.21,23.75) v1(48.21,23.04) v1(48.34,58.62) v1(48.34,57.91) v1(48.29,15.98) v1(48.29,15.27) v1(48.92,23.75) v1(48.92,23.04) v1(49.05,58.62) v1(49.05,57.91) v1(49,15.98) v1(49,15.27) v1(50.55,38.76) v1(50.55,38.05) v1(51.03,42.52) v1(51.26,38.76) v1(51.26,38.05) v1(51.74,42.52) v1(53.34,45.06) v1(54.05,45.06) v1(54.46,48.92) v1(54.46,48.21) v1(55.17,48.92) v1(55.17,48.21) v1(57.23,76.17) v1(57.23,75.46) v1(57.28,54.97) v1(57.28,54.25) v1(57.35,60.45) v1(57.35,59.74) v1(57.94,76.17) v1(57.94,75.46) v1(57.99,54.97) v1(57.99,54.25) v1(58.06,60.45) v1(58.06,59.74) v1(58.27,16.61) v1(58.27,15.9) v1(58.27,7.37) v1(58.27,6.66) v1(58.39,49.2) v1(58.39,48.49) v1(58.65,45.14) v1(59.03,42.39) v1(58.98,16.61) v1(58.98,15.9) v1(58.98,7.37) v1(58.98,6.66) v1(59.11,49.2) v1(59.1,48.49) v1(59.36,45.14) v1(59.74,42.39) v1(60.91,35.13) v1(60.91,34.42) v1(60.86,30.28) v1(60.86,29.57) v1(60.86,26.19) v1(60.86,25.48) v1(61.62,35.13) v1(61.62,34.42) v1(61.57,30.28) v1(61.57,29.57) v1(61.57,26.19) v1(61.57,25.48) v1(63.47,14.5) v1(63.5,11.23) v1(64.19,14.5) v1(64.21,11.23) v1(68.22,20.27) v1(68.22,19.56) v1(68.22,13.59) v1(68.22,12.88) v1(68.38,16.71) v1(68.38,16) v1(68.38,10.24) v1(68.38,9.53) v1(68.94,20.27) v1(68.93,19.56) v1(68.94,13.59) v1(68.93,12.88) v1(69.09,16.71) v1(69.09,16) v1(69.09,10.24) v1(69.09,9.53) v1(69.29,62) v1(69.29,61.29) v1(69.44,52.12) v1(69.44,51.41) v1(69.49,68.73) v1(69.49,68.02) v1(69.57,57.81) v1(69.57,57.1) v1(70,62) v1(70,61.29) v1(70.21,68.73) v1(70.2,68.02) v1(70.16,52.12) v1(70.15,51.41) v1(70.28,57.81) v1(70.28,57.1) v1(70.36,75.56) v1(70.36,74.85) v1(70.76,44.42) v1(71.07,75.56) v1(71.07,74.85) v1(71.48,44.42) v1(72.21,7.29) v1(72.21,6.58) v1(72.92,7.29) v1(72.92,6.58) v1(76.58,68.71) v1(76.58,68) v1(76.61,61.06) v1(76.61,60.35) v1(77.29,68.71) v1(77.29,68) v1(77.32,61.06) v1(77.32,60.35) v1(77.93,20.19) v1(77.98,16.94) v1(78.64,20.19) v1(78.69,16.94) v1(78.89,14.91) v1(78.89,14.2) v1(78.94,11.51) v1(78.94,10.79) v1(79.6,14.91) v1(79.6,14.2) v1(79.65,11.51) v1(79.65,10.79) v1(81.33,7.29) v1(81.33,6.58) v1(81.46,44.91) v1(81.46,44.2) v1(81.56,61.84) v1(81.56,60.99) v1(81.64,48.16) v1(81.64,47.45) v1(81.69,57.68) v1(81.79,53.16) v1(81.79,52.45) v1(82.04,7.29) v1(82.04,6.58) v1(82.17,44.91) v1(82.17,44.2) v1(82.27,61.84) v1(82.27,60.99) v1(82.35,48.16) v1(82.34,47.45) v1(82.4,57.68) v1(82.5,53.16) v1(82.5,52.45) v1(82.91,66.62) v1(83.62,66.62) v1(85.8,23.34) v1(86.51,23.34) v1(87.35,11.18) v1(87.35,10.47) v1(87.55,15.09) v1(87.55,14.38) v1(87.76,36.42) v1(87.76,35.71) v1(88.06,74.78) v1(88.06,74.07) v1(88.06,11.18) v1(88.06,10.47) v1(88.34,23.27) v1(88.26,15.09) v1(88.26,14.38) v1(88.54,36.37) v1(88.54,35.66) v1(88.62,12.78) v1(88.77,74.78) v1(88.77,74.07) v1(88.8,16.61) v1(89.05,23.27) v1(89.33,12.78) v1(89.38,64.69) v1(89.38,63.98) v1(89.59,16.61) v1(90.09,64.69) v1(90.09,63.98) v1(91.59,74.65) v1(91.59,73.94) v1(92.3,74.65) v1(92.3,73.94) v1(100.48,66.9) v1(100.48,66.19) v1(100.48,32.16) v1(100.48,31.44) v1(100.76,5.54) v1(100.76,4.83) v1(101.19,66.9) v1(101.19,66.19) v1(101.19,32.16) v1(101.19,31.44) v1(101.55,62.74) v1(101.55,62.03) v1(101.47,5.54) v1(101.47,4.83) v1(102.26,62.74) v1(102.26,62.03) v1(103.25,46.36) v1(103.25,45.64) v1(103.86,49.96) v1(104.01,53.37) v1(103.96,46.36) v1(103.96,45.64) v1(104.57,49.96) v1(104.72,53.37) v1(104.83,57.33) v1(104.83,56.62) v1(105.54,71.73) v1(105.54,71.02) v1(105.54,57.33) v1(105.53,56.62) v1(105.59,66.7) v1(105.59,65.99) v1(106.25,71.73) v1(106.25,71.02) v1(106.25,46.2) v1(106.3,66.7) v1(106.3,65.99)
VBAT: length 41
  Top Layer w0.762: 8.23,35.94 6.53,35.94 arc(5.63,36.31) 5.26,37.21 5.26,38.68 arc(5.01,39.28) 4.42,39.52 2.87,39.52 arc(2.8,39.55) P2.2 ; U3.3 10.22,38.05 arc(10.21,38.01) 10.17,38 10.17,37.15 arc(9.98,36.67) 9.5,36.47 8.99,36.47 arc(8.45,36.25) 8.23,35.71 arc(8.21,35.7) 8.2,35.69 R17.1 8.2,31.28 ; 8.2,31.28 arc(8.13,31.25) 8.1,31.18 8.1,19 arc(8.34,18.42) 8.92,18.19 11.73,18.19 arc(12.31,17.95) 12.55,17.37 12.55,12.92 arc(12.53,12.88) Q6.3 ; 8.2,31.28 arc(8.2,31.27) Q9.2
VCC: length 49.4
  Top Layer w0.762: U4.3 44.26,11.62 arc(44.46,11.13) 44.96,10.92 45.82,10.92 arc(46.07,11.03) 46.18,11.28 46.18,12.35 arc(46.17,12.37) U4.1 46.16,14.98 arc(45.86,15.7) 45.14,16 34.04,16 arc(33.43,15.75) 33.17,15.14 33.17,12.63 arc(33.25,12.45) C17.2
  Top Layer w2.032: Q7.3 16.74,3.81 arc(17.14,2.84) 18.11,2.44 32.77,2.44 arc(33.2,2.62) 33.38,3.05 33.38,7.16 arc(33.39,7.2) C19.1
VDD_EXT: length 85.6
  Top Layer w0.762: v1(46.81,56.26) 46.91,56.36 46.91,59.18 46.61,59.49 R1.2 arc(43.43,59.49) 43.42,59.5 43.42,61.87 ; v1(51.26,46.1) 51.26,47.65 R2.2 arc(50.61,47.95) 50.37,48.54 50.37,48.56 arc(50.26,48.83) 49.99,48.95 47.29,48.95 arc(46.94,49.09) 46.79,49.45 v1(46.79,51.71) ; v1(98.17,46.53) 98.16,46.54 U1.43
  Bottom Layer w0.762: v1(51.26,46.1) 97.74,46.1 v1(98.17,46.53) ; v1(46.81,56.26) 46.81,51.74 v1(46.79,51.71)
BAT_ADC: length 41.7
  Top Layer w0.254: 15.09,31.2 C23.2 ; 15.09,31.2 R15.1 arc(15.11,28.97) 15.11,28.96 R16.2 ; 15.09,31.2 15.23,31.06 v1(25.43,31.06) ; U5.10 42.02,38.72 arc(42.05,38.73) v1(42.06,38.76)
  Bottom Layer w0.254: v1(25.43,31.06) 25.53,31.17 41.58,31.17 42.06,31.65 v1(42.06,38.76)
BAT_ADC_EN: length 32.3
  Top Layer w0.254: v1(22.99,36.8) 13.06,36.8 12.65,36.4 R18.2 R17.2 ; 40.58,36.77 37.91,36.77 v1(37.9,36.78)
  Bottom Layer w0.254: v1(37.9,36.78) 23.01,36.78 v1(22.99,36.8)
MCU_RXD1: length 34.2
  Top Layer w0.254: 49.34,55.02 49.29,55.07 44.17,55.07 43.74,55.49 Q5.3 40.72,56.49 40.47,56.24 40.47,47.17 41.05,46.58 43.56,46.58 43.81,46.33 43.81,38.41 43.48,38.07 40.58,38.07
MCU_RXD2: length 24.5
  Top Layer w0.254: U5.18 36.33,34.17 37.01,34.85 37.01,53.85 35.94,54.91 34.7,54.91
MCU_TXD1: length 20.1
  Top Layer w0.254: Q4.2 41.45,51.6 41.45,47.42 41.73,47.14 43.87,47.14 44.2,46.81 44.2,37.69 43.92,37.42 U5.8
MCU_TXD2: length 21
  Top Layer w0.254: U5.17 36.27,34.82 36.47,35.03 36.47,51.89 35.59,52.78 34.82,52.78 34.72,52.88
NB_PSM: length 29.1
  Top Layer w0.254: U5.6 44.27,36.12 44.55,36.4 44.55,42.88 45.09,43.41 62.88,43.41 Q3.1
NB_PWR: length 42.6
  Top Layer w0.254: U5.12 32.34,38.07 31.93,38.48 31.93,47.19 v1(31.98,47.24) ; Q1.1 62.79,47.27 v1(61.52,47.27)
  Bottom Layer w0.254: v1(31.98,47.24) 61.49,47.24 v1(61.52,47.27)
NB_RST: length 44.2
  Top Layer w0.254: Q2.1 62.65,50.7 v1(61.49,50.7) ; U5.11 32.91,38.72 32.66,38.96 32.66,50.55 v1(32.64,50.57)
  Bottom Layer w0.254: 32.66,50.57 32.76,50.67 61.37,50.67 61.47,50.57 arc(61.47,50.68) 61.52,50.77
NB_RXD: length 87.8
  Top Layer w0.254: v1(85.4,43.21) 65.05,43.21 63.93,44.32 49.68,44.32 49.28,44.73 49.28,47.7 ; Q4.3 43.74,48.2 44.17,47.78 49.25,47.78 49.27,47.75 ; U1.33 107.93,50.92 108.41,50.44 108.41,43.76 v1(107.87,43.23)
  Bottom Layer w0.254: v1(85.4,43.21) 85.42,43.23 v1(107.87,43.23)
NB_TXD: length 107.7
  Top Layer w0.254: v1(42.57,54.53) 42.57,55.22 42.37,55.42 41.59,55.42 Q5.2 ; v1(38.99,54.61) 38.84,54.46 v1(38.84,46.56) ; U1.34 v1(108.15,51.92)
  Bottom Layer w0.254: v1(108.15,51.92) 109.14,51.92 109.37,51.69 109.37,41.86 109.09,41.58 39.32,41.58 38.86,42.04 38.86,46.54 v1(38.84,46.56) ; v1(38.99,54.61) 42.49,54.61 v1(42.57,54.53)
PWR_EN: length 38.4
  Top Layer w0.254: U5.13 23.91,37.42 23.57,37.08 23.57,34.47 v1(23.6,34.44) ; Q8.1 23.53,10.87 23.06,10.87 22.78,11.15 22.78,13.72 23.57,14.5 v1(23.57,29.06)
  Bottom Layer w0.254: v1(23.6,34.44) 23.6,29.08 v1(23.57,29.06)
SHUT_DOWN: length 37.8
  Top Layer w0.254: U5.14 25.01,36.77 24.56,36.32 v1(24.56,34.65) ; v1(24.54,29.82) 24.54,17.32 24.71,17.14 31.01,17.14 31.34,16.81 31.34,15.27
  Bottom Layer w0.254: v1(24.54,29.82) 24.56,29.84 v1(24.56,34.65)
SIM_CLK: length 62.1
  Top Layer w0.254: R6.1 63.75,9.78 62.92,9.78 62.71,9.98 v1(62.71,18.49) ; U1.19 v1(90.16,23.67)
  Bottom Layer w0.254: v1(90.16,23.67) 90.16,18.97 89.69,18.49 v1(62.71,18.49)
SIM_DATA: length 61
  Top Layer w0.254: U1.21 92.16,40.37 91.11,39.32 91.11,24.69 91.92,23.88 91.92,22.83 91.57,22.48 86.26,22.48 v1(86.24,22.5) 84.49,22.5 R9.2 ; R7.1 63.91,12.88 64.69,12.88 64.87,13.06 v1(64.87,21.03)
  Bottom Layer w0.254: v1(64.87,21.03) 64.9,21.06 86,21.06 86.24,21.29 v1(86.24,22.5)
SIM_GND: length 37.8
  Top Layer w0.254: 84.58,19.45 84.6,19.43 v1(87.12,19.43) ; 84.58,19.45 84.58,17.42 84.79,17.22 93.47,17.22 ; 84.58,19.45 C13.1 ; v1(87.15,24.84) 87.16,24.86 U1.16
  Bottom Layer w0.254: v1(87.12,19.43) 87.15,19.46 v1(87.15,24.84)
SIM_RST: length 55.1
  Top Layer w0.254: R8.1 63.88,16.21 v1(63.88,17.88) ; v1(91.16,23.37) 91.16,23.95 90.65,24.46 90.65,39.55 91.16,40.06 U1.20
  Bottom Layer w0.254: v1(63.88,17.88) 91.06,17.88 91.16,17.98 v1(91.16,23.37)
SIM_VDD: length 54.7
  Top Layer w0.254: U1.18 89.16,40.15 89.79,39.52 89.79,24.36 89.41,23.98 83.01,23.98 82.5,23.47 82.5,22.47 R9.1 C13.2 ; C13.2 74.6,19.46 ; C13.2 D1.1 82.55,15.41 82.55,15.8 82.7,15.94 P1.C1
VUSB: length 119.1
  Top Layer w0.762: USB1.1 15,54.57 arc(14.89,54.31) 14.63,54.2 7.05,54.2 arc(6.99,54.18) 6.96,54.11 ; 6.96,54.11 6.96,65.1 arc(7.32,65.98) 8.2,66.34 14.78,66.34 arc(15.36,66.58) 15.6,67.16 15.6,70.92 arc(15.75,71.29) 16.13,71.45 17.99,71.45 ; 6.96,54.11 v1(6.96,50.64) 6.96,48.06 arc(7.17,47.55) 7.67,47.35 10.15,47.35 arc(10.2,47.32) 10.22,47.27 ; 10.08,47.02 10.22,46.88 U3.4 12.89,43.43 R11.2 ; Q6.1 10.23,15.91 arc(10.07,16.3) 9.68,16.46 v1(3.3,16.46) arc(3,16.33) 2.87,16.03 2.87,14.58 arc(2.88,14.54) 2.92,14.53
  Bottom Layer w0.762: v1(3.3,16.46) 3.3,23.32 arc(3.11,23.78) 2.64,23.98 2.26,23.98 arc(1.38,24.34) 1.02,25.22 1.02,53.54 arc(1.21,54.01) 1.68,54.2 14.3,54.2 arc(14.82,54.42) 15.04,54.94 15.04,55.96 arc(15.03,55.99) USB1.1
$1N61: length 13.8
  Top Layer w0.254: D2.K 9.96,9.96 10.21,10.21 10.21,11.9 Q6.2 15.79,11.92 arc(15.8,11.92) R13.1 15.8,9.59 arc(15.79,9.58) Q7.2
$1N62: length 15.8
  Top Layer w0.254: U5.3 43.99,34.17 44.27,33.88 44.27,28.45 44.09,28.27 39.83,28.27 39.7,28.14 39.7,26.53 LED2.2
$1N67: length 4.2
  Top Layer w0.254: LED2.1 45.84,26.35 arc(45.85,26.35) R19.1
$1N93: length 7.5
  Top Layer w0.254: 10.1,31.27 10.1,32.68 10.82,33.4 14.38,33.4 14.63,33.66 14.63,34.72 R18.1
$1N170: length 32.8
  Top Layer w0.254: U5.19 15.61,33.52 15.11,33.02 11.56,33.02 10.95,32.41 v1(10.95,32.26)
  Bottom Layer w0.254: 10.74,31.75 P3.2 ; 10.74,31.75 10.74,31.75 ; 10.74,31.75 arc(10.94,31.96) v1(10.95,32.26) ; 10.74,31.75 arc(10.73,31.75) 10.72,31.75
$1N171: length 34.6
  Top Layer w0.254: v1(9.3,30.2) 9.32,30.17 10.58,30.17 10.83,30.43 10.83,31.15 12.3,32.61 34.32,32.61 34.58,32.87
  Bottom Layer w0.254: 9.6,30.2 v1(9.3,30.2) 2.87,30.2 arc(2.78,30.16) 2.74,30.07 2.74,29.23 arc(2.75,29.21) P3.3
$1N218: length 9.6
  Top Layer w0.254: U5.4 44.63,34.82 44.73,34.72 44.73,32.97 44.96,32.74 R14.2 45.9,30.39 arc(45.89,30.38) C20.2
$1N296: length 11
  Top Layer w0.254: D3.K D4.K 27.94,7.36 arc(27.94,7.35) K1.1
$1N321: length 9.4
  Top Layer w0.254: D3.A 21.41,11.97 arc(21.4,11.93) Q8.3 R13.2 17.73,9.61 arc(17.72,9.59) Q7.1
$1N422: length 17.6
  Top Layer w0.254: LED1.2 21.32,43.43 v1(21.41,43.33) ; v1(8.33,41.5) 8.32,41.5 U3.1
  Bottom Layer w0.254: v1(8.33,41.5) 21.16,41.5 21.41,41.76 v1(21.41,43.33)
$1N552: length 31.9
  Top Layer w0.254: 74.65,16.15 80.88,16.15 81.21,15.82 81.21,15.37 81.23,15.35 81.23,14.3 81.41,14.12 84.43,14.12 85.15,13.41 P1.C2 ; 74.65,16.15 74.65,15.21 74.37,14.94 66.09,14.94 65.79,15.24 R8.2 ; 74.65,16.15 C11.2
$1N553: length 31.6
  Top Layer w0.254: 74.62,12.92 74.67,12.87 81.21,12.87 81.21,13.47 81.46,13.72 83.24,13.72 83.64,13.31 83.64,12.55 84.02,12.17 93.43,12.17 P1.C7 ; 74.62,12.92 C10.2 ; 74.62,12.92 74.62,11.94 74.4,11.71 66.09,11.71 65.79,12.01 R7.2
$1N554: length 33.5
  Top Layer w0.254: 82.51,9.81 D1.5 ; P1.C3 93.47,10.86 93.47,9.93 93.22,9.68 74.61,9.68 74.55,9.61 74.55,8.86 74.22,8.53 66.29,8.53 65.79,9.04 R6.2
$1N639: length 2.8
  Top Layer w0.254: R5.2 77.5,53.62 arc(77.54,53.73) L1.1
$1N640: length 39.9
  Top Layer w0.254: RF2.1 76.52,75.55 75.72,74.75 L1.2 75.66,53.72 73.69,53.72 73.13,53.16 73.13,46.25 73.53,45.85 C7.1
$1N672: length 7
  Top Layer w0.254: C7.2 84.7,45.85 U1.15
$1N686: length 30.1
  Top Layer w0.254: U1.41 107.38,58.92 107.72,59.26 107.72,75.34 107.34,75.72 101.43,75.72 RF1.1
$1N731: length 11
  Top Layer w0.254: C5.1 49.34,50.4 R3.1 49.34,53.28 49.09,53.53 Q4.1
$1N792: length 64.3
  Top Layer w0.254: v1(108.41,42.47) 109.07,43.13 109.07,54.58 108.73,54.92 U1.37 ; Q3.3 86.23,42.44 v1(86.28,42.49)
  Bottom Layer w0.254: v1(108.41,42.47) 86.31,42.47 v1(86.28,42.49)
$1N808: length 40.5
  Top Layer w0.254: v1(74.9,65.18) 65.68,65.18 65.18,64.67 65.18,50.01 Q2.3 ; U1.53 88.16,64.54 87.55,65.15 v1(76.45,65.15)
  Bottom Layer w0.254: v1(76.45,65.15) 74.93,65.15 v1(74.9,65.18)
$1N824: length 28.5
  Top Layer w0.254: v1(74.19,47.17) 79.63,47.17 80.16,47.7 80.16,55.66 80.42,55.92 U1.5 ; Q1.3 65.16,47 65.33,47.17 v1(72.07,47.17)
  Bottom Layer w0.254: v1(72.07,47.17) v1(74.19,47.17)
$1N1115: length 4.3
  Top Layer w0.254: R21.1 32.38,54.53 U2.3
$1N1122: length 4.3
  Top Layer w0.254: U2.2 32.41,53.26 R20.1
$1N1125: length 29.7
  Top Layer w0.254: U2.5 30.17,57.07 30.48,57.38 30.48,62.79 29.67,63.6 20.62,63.6 20.07,63.04 20.07,60.2 19.74,59.87 13.18,59.87 12.97,59.65 USB1.3
$1N1126: length 24.7
  Top Layer w0.254: USB1.2 20.16,58.49 20.52,58.85 20.52,62.79 20.88,63.14 29.13,63.14 29.95,62.33 29.95,58.57 29.84,58.47 28.78,58.47 U2.6
$1N1265: length 4
  Top Layer w0.254: Q9.3 13.14,29 arc(13.15,29) R15.2
$1N1284: length 3.9
  Top Layer w0.254: R11.1 LED1.1 18.74,43.43
$1N1285: length 2.4
  Top Layer w0.254: R10.2 8.3,43.46 U3.5
$1N2740: length 4.5
  Top Layer w0.254: 41.36,61.87 41.36,59.63 arc(41.4,59.53) R1.1 41.5,57.47 arc(41.5,57.45) Q5.1

## Copper pours and planes (outline as drawn; the poured copper is in the pictures)
3.3V on Top Layer: 18.92,52.87 23.85,52.87 23.85,51.06 18.92,51.06
3.3V on Top Layer: 46.71,74.27 66.19,74.27 66.19,63.42 46.71,63.42
3.3V on Top Layer: 50.55,55.93 52.16,55.93 52.16,49.27 50.55,49.27
3.3V on Top Layer: 74.93,51.94 76.5,51.94 76.5,47.47 74.93,47.47
3.3V on Top Layer: 45.24,10.08 47.21,10.08 47.21,5.36 45.24,5.36
+5V0 on Top Layer: 29.08,73.32 46.84,73.32 46.84,69.8 29.08,69.8
GND on Top Layer: -13.08,91.8 125.35,91.8 125.35,-10.97 -13.08,-10.97
GND on Bottom Layer: -21.34,98.02 136.96,98.02 136.96,-16.33 -21.34,-16.33
VCC on Top Layer: 31.67,13.28 35.14,13.28 35.14,6.43 31.67,6.43
VUSB on Top Layer: 1.96,14.74 3.54,14.74 3.54,8.99 1.96,8.99
$1N1102 on Top Layer: 12.88,77.24 19.25,77.24 19.25,72.44 12.88,72.44
$1N1103 on Top Layer: 21.61,76.04 27.97,76.04 27.97,69.93 21.61,69.93

Small or netless copper shapes (teardrops, artwork), in the pictures only: 274 on Top Layer, 43 on Bottom Layer

## Text on the board
Top Silkscreen Layer: 1N170 | VBAT | 1N171 | 3.3V | GND | 6105123192
